# Altium project LIN_break2.PrjPcb
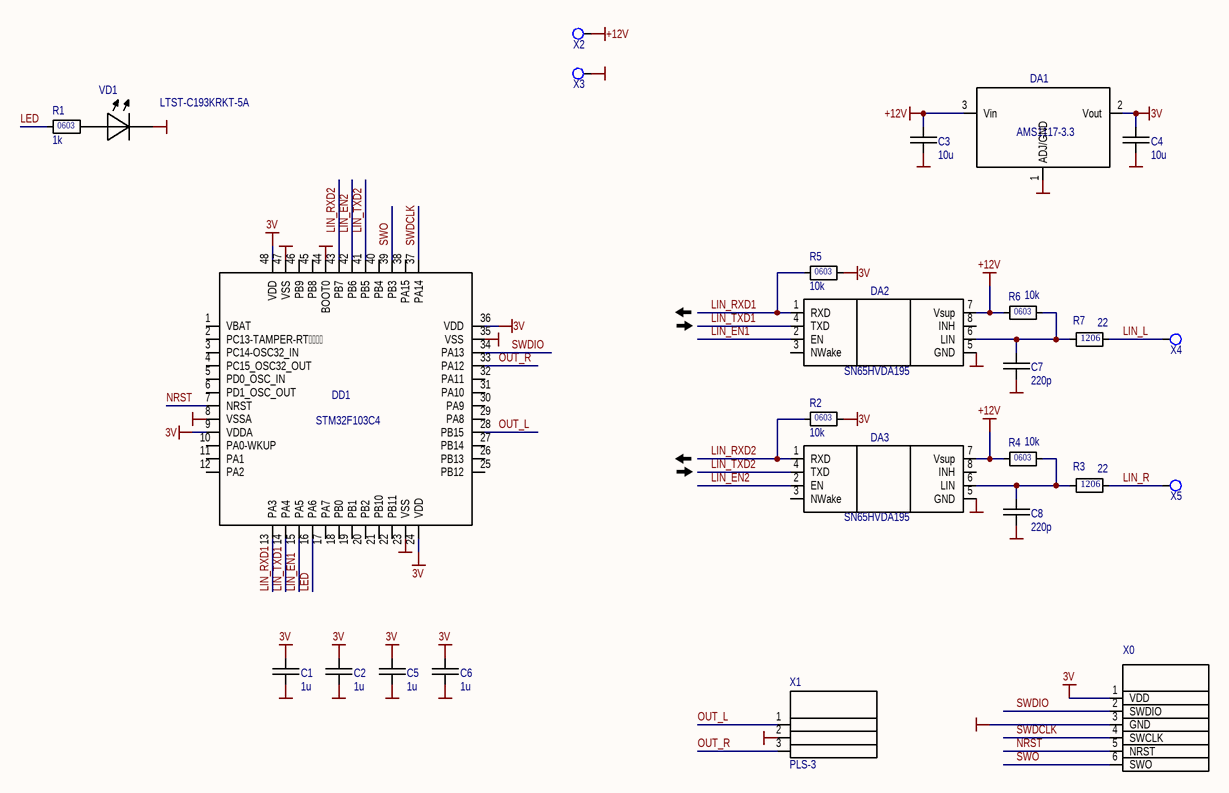
[diagram p0: LIN_break2.SchDoc]
Title: LIN Break2; Revision: Rev1
1 sheet, 26 parts. Net scope: global (net labels, ports and power ports of the same name join across sheets).
Board file: LIN_break2.PcbDoc

## Sheet LIN_break2.SchDoc: LIN Break2
size A4

### Parts
C1  1u  [C0603]
C2  1u  [C0603]
C3  10u  [C0805]
C4  10u  [C0805]
C5  1u  [C0603]
C6  1u  [C0603]
C7  220p  [C0603]
C8  220p  [C0603]
DA1  (no value)  [AMS1117-3.3]
DA2  SN65HVDA195  [TI-SOIC8 D]
DA3  SN65HVDA195  [TI-SOIC8 D]
DD1  STM32F103C4  [ST-LQFP48]
R1  1k  [R0603]
R2  10k  [R0603]
R3  22  [R1206]
R4  10k  [R0603]
R5  10k  [R0603]
R6  10k  [R0603]
R7  22  [R1206]
VD1  Part Number: LTST-C193KRKT-5A  [LTST-C193 RED]  (hidden comment: Red)
X0  STM32_SMT_DEBUG_JLINK  [STM32_DEBUG_6x1_2mm_pitch]  (value not drawn)  (no BOM)
X1  PLS-3  [PLS-3]
X2  1-pin_round NB  [Hole-1-1.6]  (value not drawn)  (no BOM)
X3  1-pin_round NB  [Hole-1-1.6]  (value not drawn)  (no BOM)
X4  1-pin_round NB  [Hole-1-1.6]  (value not drawn)  (no BOM)
X5  1-pin_round NB  [Hole-1-1.6]  (value not drawn)  (no BOM)

### Nets
3V: C1.1 C2.1 C4.1 C5.1 C6.1 DA1.2(Vout) DD1.9(VDDA) DD1.24(VDD) DD1.36(VDD) DD1.48(VDD) R2.2 R5.2 X0.1(VDD)
+12V: C3.1 DA1.3(Vin) DA2.7(Vsup) DA3.7(Vsup) R4.1 R6.1 X2.1
GND: C1.2 C2.2 C3.2 C4.2 C5.2 C6.2 C7.2 C8.2 DA1.1(ADJ/GND) DA2.5(GND) DA3.5(GND) DD1.8(VSSA) DD1.23(VSS) DD1.35(VSS) DD1.44(BOOT0) DD1.47(VSS) VD1.1(C) X0.3(GND) X1.2 X3.1
LED: DD1.16(PA6) R1.1
LIN_EN1: DA2.2(EN) DD1.15(PA5)
LIN_EN2: DA3.2(EN) DD1.42(PB6)
LIN_L: R7.2 X4.1
LIN_R: R3.2 X5.1
LIN_RXD1: DA2.1(RXD) DD1.13(PA3) R5.1
LIN_RXD2: DA3.1(RXD) DD1.43(PB7) R2.1
LIN_TXD1: DA2.4(TXD) DD1.14(PA4)
LIN_TXD2: DA3.4(TXD) DD1.41(PB5)
NRST: DD1.7(NRST) X0.5(NRST)
OUT_L: DD1.28(PB15) X1.1
OUT_R: DD1.33(PA12) X1.3
SWDCLK: DD1.37(PA14) X0.4(SWCLK)
SWDIO: DD1.34(PA13) X0.2(SWDIO)
SWO: DD1.39(PB3) X0.6(SWO)
NetC7_1: C7.1 DA2.6(LIN) R6.2 R7.1
NetC8_1: C8.1 DA3.6(LIN) R3.1 R4.2
NetR1_2: R1.2 VD1.2(A)

Not connected (* = marked no-connect by the designer): DA2 3(NWake) 8(INH); DA3 3(NWake) 8(INH); DD1 1(VBAT) 2(PC13-TAMPER-RT) 3(PC14-OSC32_IN) 4(PC15_OSC32_OUT) 5(PD0_OSC_IN) 6(PD1_OSC_OUT) 10(PA0-WKUP) 11(PA1) 12(PA2) 17(PA7) 18(PB0) 19(PB1) 20(PB2) 21(PB10) 22(PB11) 25(PB12) 26(PB13) 27(PB14) 29(PA8) 30(PA9) 31(PA10) 32(PA11) 38(PA15) 40(PB4) 45(PB8) 46(PB9)

### Notes on the sheet
- Title
- Size:
- Date:
- A4
- Number:
- Time:
- Revision:
- Sheet
- of
- File:
- (in symbol R0603 1k ±1% E24) 0603
- (in symbol R1206 22 1%) 1206

### Library data of the parts
C1 C2 C5 C6 = C0603 1u 10V X6S 105°C ±20%: General  ceramic capacitor; Part Number: GRM185C81A105ME36#; Voltage: 10V; Tolerance: ±20%; Vendor: Murata; Component Name: C0603 1u 10V X6S 105°C ±20%; Temperature: 105°C; Pins: 2; Package: C0603; Value: 1u; LCSC Part #: C15849
C3 C4 = C0805 10u 10V X6S 105°C ±10%: General  ceramic capacitor; Part Number: GRM21BC81A106KE18#; Voltage: 10V; Tolerance: ±10%; Vendor: Murata; Component Name: C0805 10u 10V X6S 105°C ±10%; Temperature: 105°C; Pins: 2; Package: C0805; Value: 10u; LCSC Part #: C1046
C7 C8 = C0603 220p 100V X7R 125°C ±20%: General  ceramic capacitor; Part Number: GRM188R72A221MA01#; Voltage: 100V; Dielectric: X7R; Tolerance: ±20%; Vendor: Murata; Component Name: C0603 220p 100V X7R 125°C ±20%; HelpURL: https://psearch.en.murata.com/capacitor/result/smd/?pid=GRM188R72A221MA01#; Temperature: 125°C; Pins: 2; Package: C0603; Value: 220p
DA1 = AMS1117-3.3: LDO ADJ 0.8mA; Component Name: AMS1117-3.3; HelpURL: https://lcsc.com/product-detail/Linear-Voltage-Regulators-LDO_Slkor-SLKORMICRO-Elec-AMS1117-3-3_C426566.html; Pins: 4; Package: SOT-223; LCSC Part #: C426566; Part Number: AMS1117-3.3
DA2 DA3 = SN65HVDA195: LIN driver; Part Number: SN65HVDA195QDRQ1; Vendor: TI; Component Name: SN65HVDA195; HelpURL: http://www.ti.com/lit/ds/symlink/sn65hvda195-q1.pdf; Pins: 8; Package: SOIC – D; Value: LIN; LCSC Part #: C140290
DD1 = STM32F103C4: 16K Flash, 48 pins; Vendor: ST; Component Name: STM32F103C4; Part Number: STM32F103C4; HelpURL: https://www.st.com/en/microcontrollers-microprocessors/stm32f103c6.html; Pins: 100; Package: LQFP48; Value: STM32F103C4
R1 R2 R4-R6 = R0603 1k ±1% E24: Thick Film Chip Resistor - CR Series; Part Number: CR-03FL7----1k; Vendor: Viking; Tolerance: ±1%; Voltage: 75V; Component Name: R0603 1k ±1% E24; Pins: 2; Package: R0603; LCSC Part #: C21190
  R1: HelpURL: https://www.viking.com.tw/en/search/index.html?f%5Bname_model%5D=CR-03FL7----1k&type=product; Value: 1k
  R2 R4-R6: Value: 10k
R3 R7 = R1206 22 1%: 1/4W 200V; Part Number: CR-06FL5--22R0; Vendor: Viking; Component Name: R1206 22 1%; Pins: 2; Package: R1206; Value: 22
VD1 = 0603 0h35 5mA RED KRKT: TopView Single Color Chip LED; Vendor: Lite-On; WaveLength: 631 @ 5mA; Component Name: 0603 0h35 5mA RED KRKT; HelpURL: https://lcsc.com/product-detail/Light-Emitting-Diodes-LED_Lite-On-LTST-C193KRKT-5A_C157741.html; Pins: 2; Package: 0603 0h35; Value: Red; LCSC Part #: C157741
X0 = Debug6SMT_2mm: Trace-Asynchronous_SW; Value: SWD TH; Component Name: Debug6SMT_2mm; Pins: 6; Package: TH
X2-X5 = Hole-1-1.6: Component Name: Hole-1-1.6; Pins: 1; Price: 0; Value: Hole-1-1.6
X1 = PLS-3: Component Name: PLS-3; Part Number: PLS-3; Pins: 3; Value: PLS-3

## Assembly variants
JLCSMT: not fitted C3 C4 DA1 DD1 DD2 R22 R24 R26 R28 R30 R32 R34 R36 R38 R40 R42 R44 R46 R48 R50 R52 VD17 VD18 VD19 VD20 VD21 VD22 VD23 VD24 X1 X2